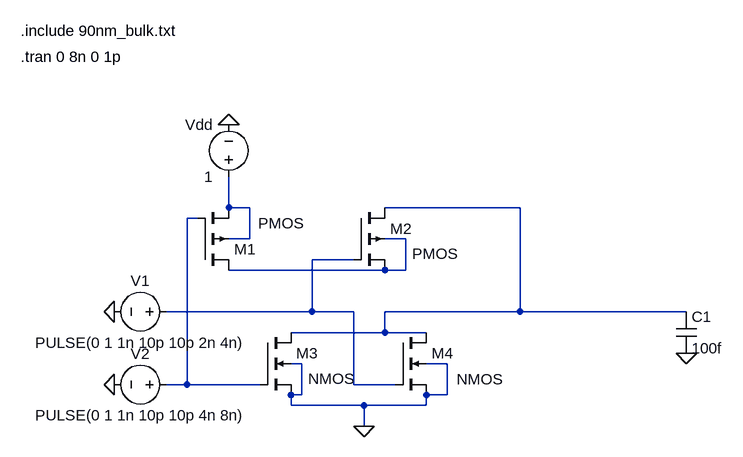
[diagram p0: schematic or-no_mosfet.asc]
or-no_mosfet.asc, the LTspice schematic file:
Version 4
SHEET 1 1004 680
WIRE 208 144 208 96
WIRE 240 144 208 144
WIRE 656 144 448 144
WIRE 160 160 144 160
WIRE 240 192 240 144
WIRE 240 192 208 192
WIRE 480 192 448 192
WIRE 400 224 336 224
WIRE 448 240 208 240
WIRE 480 240 480 192
WIRE 480 240 448 240
WIRE 336 304 336 224
WIRE 336 304 112 304
WIRE 400 304 336 304
WIRE 656 304 656 144
WIRE 656 304 448 304
WIRE 912 304 656 304
WIRE 448 336 448 304
WIRE 448 336 304 336
WIRE 512 336 448 336
WIRE 320 384 304 384
WIRE 544 384 512 384
WIRE 144 416 144 160
WIRE 144 416 112 416
WIRE 256 416 144 416
WIRE 400 416 400 304
WIRE 464 416 400 416
WIRE 320 432 320 384
WIRE 320 432 304 432
WIRE 544 432 544 384
WIRE 544 432 512 432
WIRE 304 448 304 432
WIRE 416 448 304 448
WIRE 512 448 512 432
WIRE 512 448 416 448
WIRE 416 480 416 448
FLAG 416 480 0
FLAG 32 416 0
FLAG 32 304 0
FLAG 208 16 0
FLAG 912 368 0
SYMBOL voltage 128 304 R90
WINDOW 0 -32 56 VBottom 2
WINDOW 3 32 56 VTop 2
WINDOW 123 0 0 Left 0
WINDOW 39 0 0 Left 0
SYMATTR InstName V1
SYMATTR Value PULSE(0 1 1n 10p 10p 2n 4n)
SYMBOL voltage 128 416 R90
WINDOW 0 -32 56 VBottom 2
WINDOW 3 32 56 VTop 2
WINDOW 123 0 0 Left 0
WINDOW 39 0 0 Left 0
SYMATTR InstName V2
SYMATTR Value PULSE(0 1 1n 10p 10p 4n 8n)
SYMBOL voltage 208 112 R180
WINDOW 0 24 96 Left 2
WINDOW 3 24 16 Left 2
WINDOW 123 0 0 Left 0
WINDOW 39 0 0 Left 0
SYMATTR InstName Vdd
SYMATTR Value 1
SYMBOL pmos4 160 240 M180
WINDOW 3 93 72 Left 2
SYMATTR InstName M1
SYMATTR Value2 l=90n w=400n
SYMBOL pmos4 400 144 R0
WINDOW 3 90 71 Left 2
SYMATTR InstName M2
SYMATTR Value2 l=90n w=400n
SYMBOL nmos4 256 336 R0
WINDOW 3 74 71 Left 2
SYMATTR InstName M3
SYMATTR Value2 l=90n w=200n
SYMBOL nmos4 464 336 R0
WINDOW 3 95 72 Left 2
SYMATTR InstName M4
SYMATTR Value2 l=90n w=200n
SYMBOL cap 896 304 R0
SYMATTR InstName C1
SYMATTR Value 100f
TEXT -112 -128 Left 2 !.include 90nm_bulk.txt
TEXT -112 -88 Left 2 !.tran 0 8n 0 1p

The netlist it stands for:
* or-no_mosfet.asc
V1 N005 0 PULSE(0 1 1n 10p 10p 2n 4n)
V2 N003 0 PULSE(0 1 1n 10p 10p 4n 8n)
Vdd N001 0 1
M1 N004 N003 N001 N001 PMOS l=90n w=400n
M2 N002 N005 N004 N004 PMOS l=90n w=400n
M3 N002 N003 0 0 NMOS l=90n w=200n
M4 N002 N005 0 0 NMOS l=90n w=200n
C1 N002 0 100f
.model NMOS NMOS
.model PMOS PMOS
.lib standard.mos
.include 90nm_bulk.txt
.tran 0 8n 0 1p
.backanno
.end